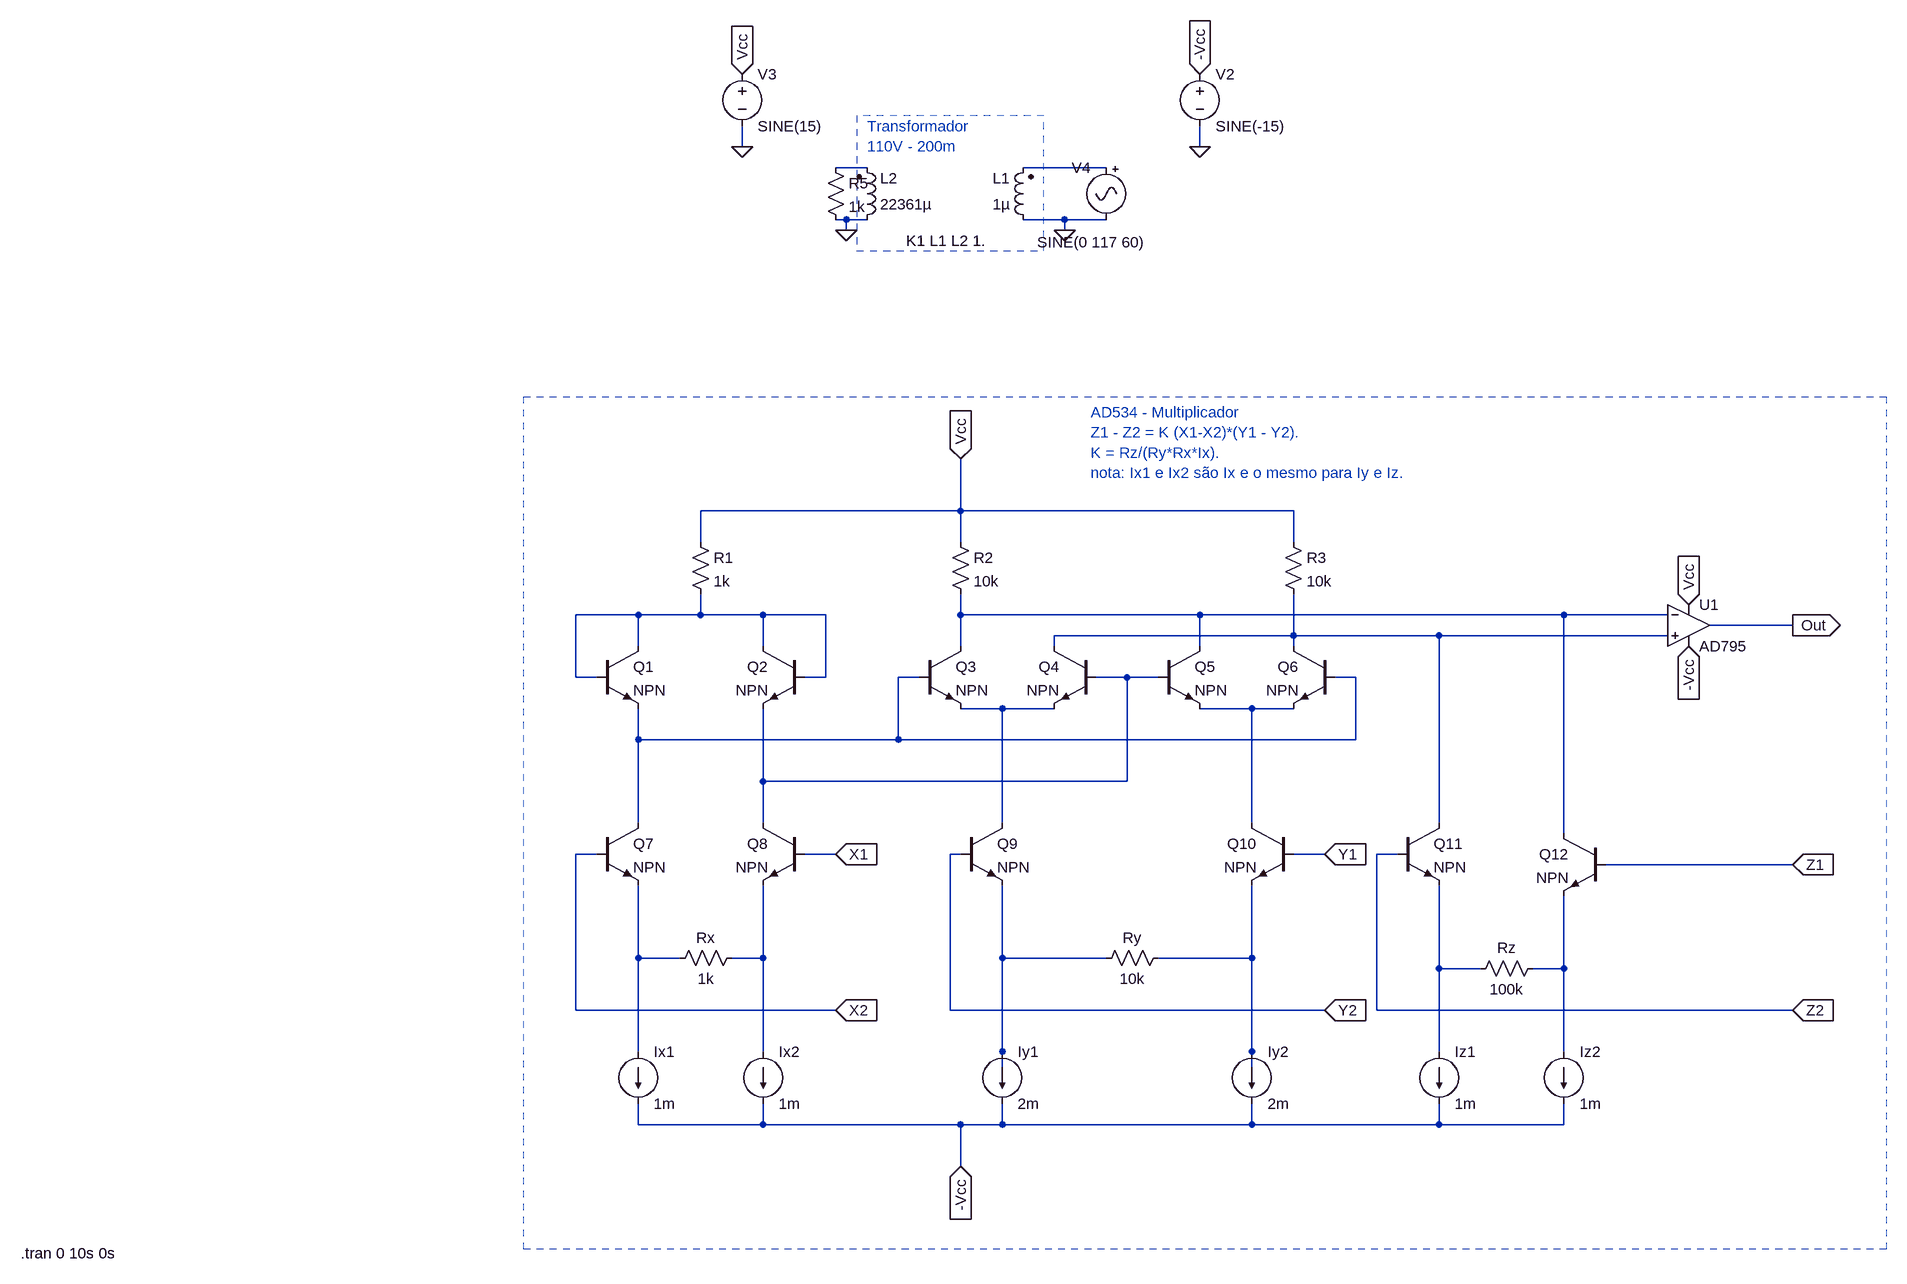
[diagram p0: schematic AD534 - Multiplicador.asc]
AD534 - Multiplicador.asc, the LTspice schematic file:
Version 4
SHEET 1 1232 932
WIRE -992 -1168 -992 -1200
WIRE -288 -1168 -288 -1200
WIRE -800 -1136 -848 -1136
WIRE -432 -1136 -560 -1136
WIRE -832 -1056 -848 -1056
WIRE -800 -1056 -832 -1056
WIRE -496 -1056 -560 -1056
WIRE -432 -1056 -496 -1056
WIRE -832 -1040 -832 -1056
WIRE -496 -1040 -496 -1056
WIRE -656 -608 -656 -688
WIRE -656 -608 -1056 -608
WIRE -144 -608 -656 -608
WIRE -1056 -560 -1056 -608
WIRE -656 -560 -656 -608
WIRE -144 -560 -144 -608
WIRE -1152 -448 -1248 -448
WIRE -1056 -448 -1056 -480
WIRE -1056 -448 -1152 -448
WIRE -960 -448 -1056 -448
WIRE -864 -448 -960 -448
WIRE -656 -448 -656 -480
WIRE -288 -448 -656 -448
WIRE 272 -448 -288 -448
WIRE 432 -448 272 -448
WIRE 624 -432 496 -432
WIRE -144 -416 -144 -480
WIRE -144 -416 -512 -416
WIRE 80 -416 -144 -416
WIRE 432 -416 80 -416
WIRE -1152 -400 -1152 -448
WIRE -960 -400 -960 -448
WIRE -656 -400 -656 -448
WIRE -512 -400 -512 -416
WIRE -288 -400 -288 -448
WIRE -144 -400 -144 -416
WIRE -1248 -352 -1248 -448
WIRE -1216 -352 -1248 -352
WIRE -864 -352 -864 -448
WIRE -864 -352 -896 -352
WIRE -720 -352 -752 -352
WIRE -400 -352 -448 -352
WIRE -352 -352 -400 -352
WIRE -48 -352 -80 -352
WIRE -592 -304 -656 -304
WIRE -512 -304 -592 -304
WIRE -208 -304 -288 -304
WIRE -144 -304 -208 -304
WIRE -1152 -256 -1152 -304
WIRE -752 -256 -752 -352
WIRE -752 -256 -1152 -256
WIRE -48 -256 -48 -352
WIRE -48 -256 -752 -256
WIRE -960 -192 -960 -304
WIRE -400 -192 -400 -352
WIRE -400 -192 -960 -192
WIRE -1152 -128 -1152 -256
WIRE -960 -128 -960 -192
WIRE -592 -128 -592 -304
WIRE -208 -128 -208 -304
WIRE 80 -128 80 -416
WIRE 272 -112 272 -448
WIRE -1216 -80 -1248 -80
WIRE -848 -80 -896 -80
WIRE -656 -80 -672 -80
WIRE -96 -80 -144 -80
WIRE 16 -80 -16 -80
WIRE 624 -64 336 -64
WIRE -1152 80 -1152 -32
WIRE -1088 80 -1152 80
WIRE -960 80 -960 -32
WIRE -960 80 -1008 80
WIRE -592 80 -592 -32
WIRE -432 80 -592 80
WIRE -208 80 -208 -32
WIRE -208 80 -352 80
WIRE 80 96 80 -32
WIRE 144 96 80 96
WIRE 272 96 272 -16
WIRE 272 96 224 96
WIRE -1248 160 -1248 -80
WIRE -848 160 -1248 160
WIRE -672 160 -672 -80
WIRE -96 160 -672 160
WIRE -16 160 -16 -80
WIRE 624 160 -16 160
WIRE -1152 224 -1152 80
WIRE -960 224 -960 80
WIRE -592 224 -592 80
WIRE -208 224 -208 80
WIRE 80 224 80 96
WIRE 272 224 272 96
WIRE -592 272 -592 224
WIRE -208 272 -208 224
WIRE -1152 336 -1152 304
WIRE -960 336 -960 304
WIRE -960 336 -1152 336
WIRE -656 336 -960 336
WIRE -592 336 -592 304
WIRE -592 336 -656 336
WIRE -208 336 -208 304
WIRE -208 336 -592 336
WIRE 80 336 80 304
WIRE 80 336 -208 336
WIRE 272 336 272 304
WIRE 272 336 80 336
WIRE -656 400 -656 336
FLAG -992 -1280 Vcc
IOPIN -992 -1280 In
FLAG -992 -1168 0
FLAG -496 -1040 0
FLAG -832 -1040 0
FLAG 464 -464 Vcc
IOPIN 464 -464 In
FLAG -288 -1280 -Vcc
IOPIN -288 -1280 In
FLAG -288 -1168 0
FLAG 464 -400 -Vcc
IOPIN 464 -400 In
FLAG -848 -80 X1
IOPIN -848 -80 In
FLAG -848 160 X2
IOPIN -848 160 In
FLAG -96 -80 Y1
IOPIN -96 -80 In
FLAG -96 160 Y2
IOPIN -96 160 In
FLAG 624 -64 Z1
IOPIN 624 -64 In
FLAG 624 160 Z2
IOPIN 624 160 In
FLAG 624 -432 Out
IOPIN 624 -432 Out
FLAG -656 -688 Vcc
IOPIN -656 -688 In
FLAG -656 400 -Vcc
IOPIN -656 400 In
SYMBOL voltage -992 -1296 R0
WINDOW 123 0 0 Left 2
WINDOW 39 0 0 Left 2
SYMATTR InstName V3
SYMATTR Value SINE(15)
SYMBOL ind2 -544 -1040 R180
WINDOW 0 36 80 Left 2
WINDOW 3 36 40 Left 2
SYMATTR InstName L1
SYMATTR Value 1µ
SYMATTR SpiceLine Rser=100
SYMBOL ind2 -816 -1040 M180
WINDOW 0 36 80 Left 2
WINDOW 3 36 40 Left 2
SYMATTR InstName L2
SYMATTR Value 22361µ
SYMATTR SpiceLine Rser=100
SYMBOL Misc\\signal -432 -1152 M0
WINDOW 3 -60 131 Left 2
WINDOW 123 0 0 Left 2
WINDOW 39 0 0 Left 2
SYMATTR Value SINE(0 117 60)
SYMATTR InstName V4
SYMBOL res -864 -1152 R0
SYMATTR InstName R5
SYMATTR Value 1k
SYMBOL npn -1216 -400 R0
SYMATTR InstName Q1
SYMBOL npn -896 -400 M0
SYMATTR InstName Q2
SYMBOL npn -720 -400 R0
SYMATTR InstName Q3
SYMBOL npn -448 -400 M0
SYMATTR InstName Q4
SYMBOL npn -352 -400 R0
SYMATTR InstName Q5
SYMBOL npn -80 -400 M0
SYMATTR InstName Q6
SYMBOL npn -1216 -128 R0
SYMATTR InstName Q7
SYMBOL npn -896 -128 M0
SYMATTR InstName Q8
SYMBOL npn -656 -128 R0
SYMATTR InstName Q9
SYMBOL npn -144 -128 M0
SYMATTR InstName Q10
SYMBOL npn 16 -128 R0
SYMATTR InstName Q11
SYMBOL npn 336 -112 M0
SYMATTR InstName Q12
SYMBOL res -1072 -576 R0
SYMATTR InstName R1
SYMATTR Value 1k
SYMBOL res -672 -576 R0
SYMATTR InstName R2
SYMATTR Value 10k
SYMBOL res -160 -576 R0
SYMATTR InstName R3
SYMATTR Value 10k
SYMBOL res -992 64 R90
WINDOW 0 0 56 VBottom 2
WINDOW 3 32 56 VTop 2
SYMATTR InstName Rx
SYMATTR Value 1k
SYMBOL res -336 64 R90
WINDOW 0 0 56 VBottom 2
WINDOW 3 32 56 VTop 2
SYMATTR InstName Ry
SYMATTR Value 10k
SYMBOL res 240 80 R90
WINDOW 0 0 56 VBottom 2
WINDOW 3 32 56 VTop 2
SYMATTR InstName Rz
SYMATTR Value 100k
SYMBOL current -1152 224 R0
WINDOW 123 0 0 Left 2
WINDOW 39 0 0 Left 2
SYMATTR InstName Ix1
SYMATTR Value 1m
SYMBOL current -960 224 R0
WINDOW 123 0 0 Left 2
WINDOW 39 0 0 Left 2
SYMATTR InstName Ix2
SYMATTR Value 1m
SYMBOL current -592 224 R0
WINDOW 123 0 0 Left 2
WINDOW 39 0 0 Left 2
SYMATTR InstName Iy1
SYMATTR Value 2m
SYMBOL current -208 224 R0
WINDOW 123 0 0 Left 2
WINDOW 39 0 0 Left 2
SYMATTR InstName Iy2
SYMATTR Value 2m
SYMBOL current 80 224 R0
WINDOW 123 0 0 Left 2
WINDOW 39 0 0 Left 2
SYMATTR InstName Iz1
SYMATTR Value 1m
SYMBOL current 272 224 R0
WINDOW 123 0 0 Left 2
WINDOW 39 0 0 Left 2
SYMATTR InstName Iz2
SYMATTR Value 1m
SYMBOL voltage -288 -1296 R0
WINDOW 123 0 0 Left 2
WINDOW 39 0 0 Left 2
SYMATTR InstName V2
SYMATTR Value SINE(-15)
SYMBOL Opamps\\AD795 464 -496 R0
SYMATTR InstName U1
TEXT -616 -1024 Right 2 !K1 L1 L2 1.
TEXT -800 -1200 Left 2 ;Transformador \n110V - 200m
TEXT -456 -760 Left 2 ;AD534 - Multiplicador\nZ1 - Z2 = K (X1-X2)*(Y1 - Y2).\nK = Rz/(Ry*Rx*Ix).\nnota: Ix1 e Ix2 são Ix e o mesmo para Iy e Iz.
TEXT -2102 534 Left 2 !.tran 0 10s 0s
LINE Normal -528 -1008 -528 -1216 2
LINE Normal -816 -1008 -528 -1008 2
LINE Normal -816 -1216 -816 -1008 2
LINE Normal -528 -1216 -816 -1216 2
RECTANGLE Normal 768 528 -1328 -784 2

The netlist it stands for:
* AD534 - Multiplicador.asc
V3 Vcc 0 SINE(15)
L1 0 N002 1µ Rser=100
L2 0 N001 22361µ Rser=100
V4 N002 0 SINE(0 117 60)
R5 N001 0 1k
Q1 N003 N003 N006 0 NPN
Q2 N003 N003 N007 0 NPN
Q3 N004 N006 N008 0 NPN
Q4 N005 N007 N008 0 NPN
Q5 N004 N007 N009 0 NPN
Q6 N005 N006 N009 0 NPN
Q7 N006 X2 N010 0 NPN
Q8 N007 X1 N011 0 NPN
Q9 N008 Y2 N012 0 NPN
Q10 N009 Y1 N013 0 NPN
Q11 N005 Z2 N014 0 NPN
Q12 N004 Z1 N015 0 NPN
R1 Vcc N003 1k
R2 Vcc N004 10k
R3 Vcc N005 10k
Rx N011 N010 1k
Ry N013 N012 10k
Rz N015 N014 100k
Ix1 N010 -Vcc 1m
Ix2 N011 -Vcc 1m
Iy1 N012 -Vcc 2m
Iy2 N013 -Vcc 2m
Iz1 N014 -Vcc 1m
Iz2 N015 -Vcc 1m
V2 -Vcc 0 SINE(-15)
XU1 N005 N004 Vcc -Vcc Out AD795  ; pins In+ In- V+ V- OUT
.model NPN NPN
.model PNP PNP
.lib standard.bjt
K1 L1 L2 1.
* Transformador
* 110V - 200m
* AD534 - Multiplicador
* Z1 - Z2 = K (X1-X2)*(Y1 - Y2).
* K = Rz/(Ry*Rx*Ix).
* nota: Ix1 e Ix2 são Ix e o mesmo para Iy e Iz.
.tran 0 10s 0s
.lib ADI1.lib
.backanno
.end